# Altium project remote control.PrjPCB
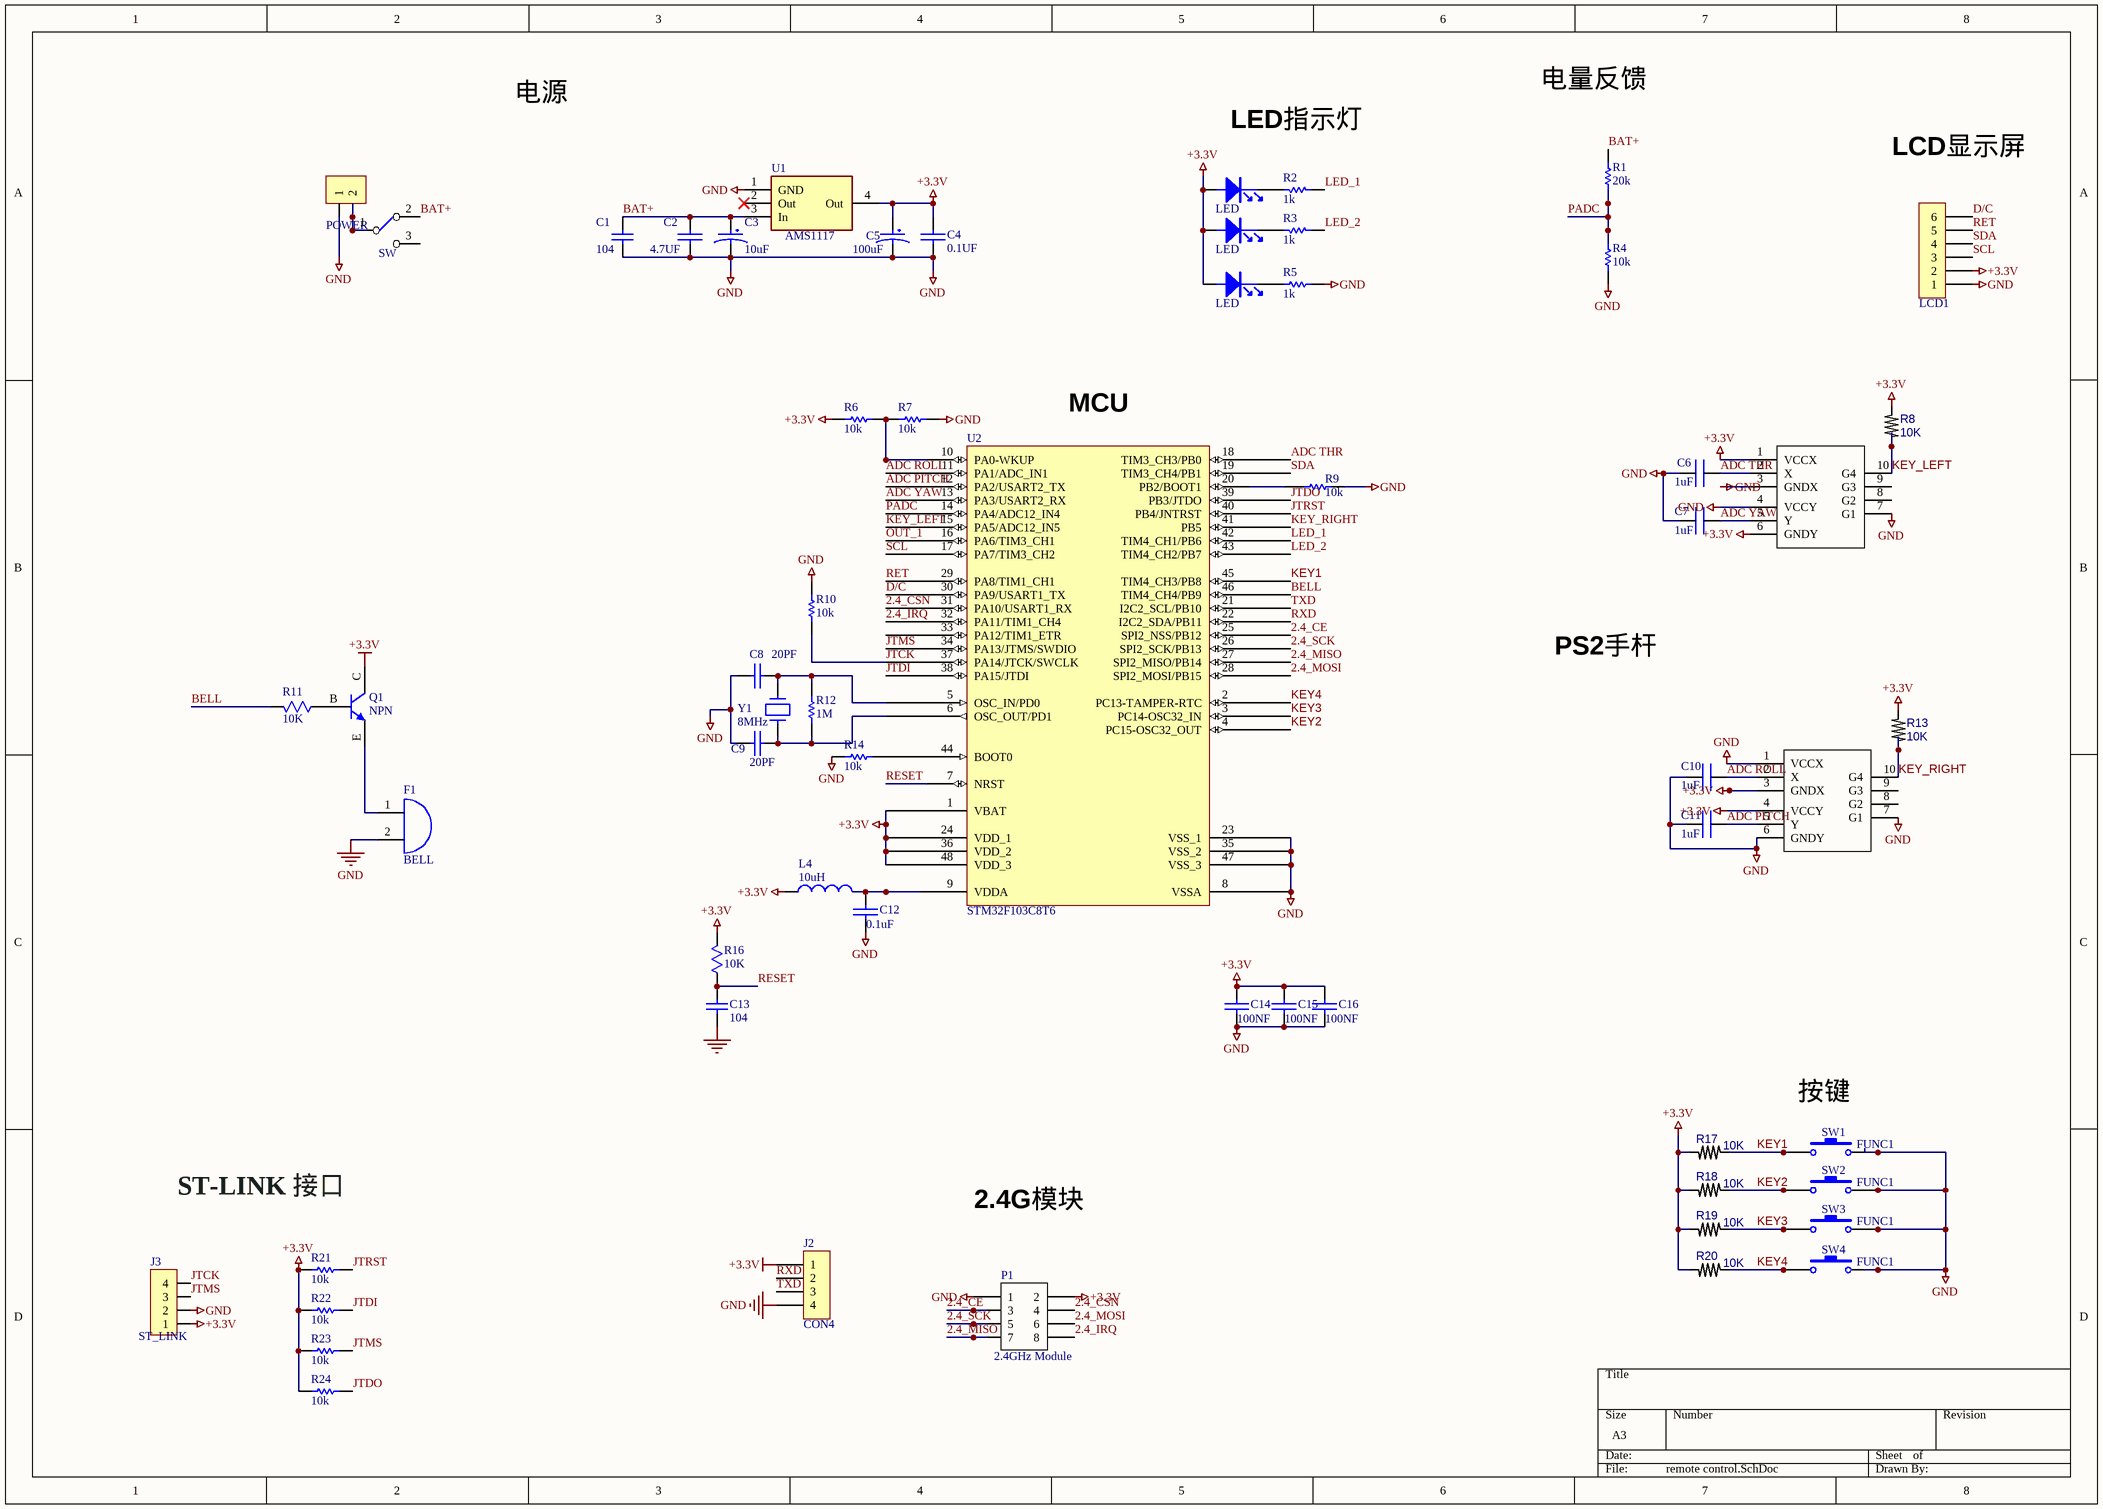
[diagram p0: remote control.SchDoc]
1 sheet, 60 parts. Net scope: global (net labels, ports and power ports of the same name join across sheets).
Board file: remote control.PcbDoc

## Sheet remote control.SchDoc
size A3

### Parts
C1  104  [0805C]
C2  4.7UF  [1206C]
C3  val: 10uF  [C_EC]  (hidden comment: CAPE)
C4  0.1UF  [0805C]
C5  val: 100uF  [C_ED8]  (hidden comment: CAPE)
C6  1uF  [0805C]
C7  1uF  [0805]
C8  20PF  [0805C]
C9  20PF  [0805C]
C10  1uF  [0805]
C11  1uF  [0805]
C12  0.1uF  [0805C]
C13  104  [0805C]
C14  100NF  [0805C]
C15  100NF  [0805C]
C16  100NF  [0805C]
control_L1  Joy Stick  [PS2]  (value not drawn)
control_R1  Joy Stick  [PS2]  (value not drawn)
F1  BELL  [BELL]
J1  POWER  [SIP2]
J2  CON4  [SIP4]
J3  ST_LINK  [P4_2.54-1]
L1  LED  [0805D]
L2  LED  [0805D]
L3  LED  [0805D]
L4  Val: 10uH  [0805]  (hidden comment: INDUCTOR)
LCD1  CON6  [SIP6]  (value not drawn)
P1  2.4GHz Module  [2.4Gmedal]
Q1  NPN  [SOT-23(BEC-123)]
R1  Val: 20k  [0805]  (hidden comment: RES)
R2  value 1k  [0805R]  (hidden comment: Res1)
R3  value 1k  [0805R]  (hidden comment: Res1)
R4  Val: 10k  [0805]  (hidden comment: RES)
R5  value 1k  [0805R]  (hidden comment: Res1)
R6  Val: 10k  [0805]  (hidden comment: RES)
R7  Val: 10k  [0805R]  (hidden comment: RES)
R8  10K  [0805R]
R9  Val: 10k  [0805R]  (hidden comment: RES)
R10  Val: 10k  [0805R]  (hidden comment: RES)
R11  10K  [0805R]
R12  Val: 1M  [0805R]  (hidden comment: RES)
R13  10K  [0805R]
R14  Val: 10k  [0805R]  (hidden comment: RES)
R16  10K  [0805R]
R17  10K  [0805C]
R18  10K  [0805C]
R19  10K  [0805C]
R20  10K  [0805C]
R21  Val: 10k  [0805R]  (hidden comment: RES)
R22  Val: 10k  [0805R]  (hidden comment: RES)
R23  Val: 10k  [0805R]  (hidden comment: RES)
R24  Val: 10k  [0805R]  (hidden comment: RES)
S1  SW  [KEY_DIP_12D07-4]
SW1  FUNC1  [KEY_SIM_6X6]
SW2  FUNC1  [KEY_SIM_6X6]
SW3  FUNC1  [KEY_SIM_6X6]
SW4  FUNC1  [KEY_SIM_6X6]
U1  AMS1117  [SOT223]
U2  STM32F103C8T6  [LQFP48]
Y1  Val: 8MHz  [HC-49T]  (hidden comment: CRYSTAL1)

### Nets
+3.3V: C4.1 C5.1 C14.1 C15.1 C16.1 control_L1.1(VCCX) control_L1.6(GNDY) control_R1.3(GNDX) control_R1.4(VCCY) J2.1 J3.1 L1.1 L2.1 L3.1 L4.1 LCD1.2 P1.2 Q1.C R6.2 R8.2 R13.2 R16.2 R17.1 R18.1 R19.1 R20.1 R21.2 R22.2 R23.2 R24.2 U1.4(Out) U2.1(VBAT) U2.24(VDD_1) U2.36(VDD_2) U2.48(VDD_3)
GND: C1.2 C2.2 C3.2 C4.2 C5.2 C6.1 C7.1 C8.1 C9.1 C10.1 C11.1 C12.2 C13.1 C14.2 C15.2 C16.2 control_L1.3(GNDX) control_L1.4(VCCY) control_L1.7(G1) control_R1.1(VCCX) control_R1.6(GNDY) control_R1.7(G1) F1.2(B) J1.1 J2.4 J3.2 LCD1.1 P1.1 R4.1 R5.1 R7.1 R9.2 R10.2 R14.2 SW1.1 SW2.1 SW3.1 SW4.1 U1.1(GND) U2.8(VSSA) U2.23(VSS_1) U2.35(VSS_2) U2.47(VSS_3)
2.4_CE: P1.3 U2.25(SPI2_NSS/PB12)
2.4_CSN: P1.4 U2.31(PA10/USART1_RX)
2.4_IRQ: P1.8 U2.32(PA11/TIM1_CH4)
2.4_MISO: P1.7 U2.27(SPI2_MISO/PB14)
2.4_MOSI: P1.6 U2.28(SPI2_MOSI/PB15)
2.4_SCK: P1.5 U2.26(SPI2_SCK/PB13)
ADC PITCH: C11.2 control_R1.5(Y) U2.12(PA2/USART2_TX)
ADC ROLL: C10.2 control_R1.2(X) U2.11(PA1/ADC_IN1)
ADC THR: C6.2 control_L1.2(X) U2.18(TIM3_CH3/PB0)
ADC YAW: C7.2 control_L1.5(Y) U2.13(PA3/USART2_RX)
BAT+: C1.1 C2.1 C3.1 R1.2 S1.2 U1.3(In)
BELL: R11.2 U2.46(TIM4_CH4/PB9)
D/C: LCD1.6 U2.30(PA9/USART1_TX)
JTCK: J3.4 R10.1 U2.37(PA14/JTCK/SWCLK)
JTDI: R22.1 U2.38(PA15/JTDI)
JTDO: R24.1 U2.39(PB3/JTDO)
JTMS: J3.3 R23.1 U2.34(PA13/JTMS/SWDIO)
JTRST: R21.1 U2.40(PB4/JNTRST)
KEY1: R17.2 SW1.2 U2.45(TIM4_CH3/PB8)
KEY2: R18.2 SW2.2 U2.4(PC15-OSC32_OUT)
KEY3: R19.2 SW3.2 U2.3(PC14-OSC32_IN)
KEY4: R20.2 SW4.2 U2.2(PC13-TAMPER-RTC)
KEY_LEFT: control_L1.10(G4) R8.1 U2.15(PA5/ADC12_IN5)
KEY_RIGHT: control_R1.10(G4) R13.1 U2.41(PB5)
LED_1: R2.1 U2.42(TIM4_CH1/PB6)
LED_2: R3.1 U2.43(TIM4_CH2/PB7)
OUT_1: U2.16(PA6/TIM3_CH1)
PADC: R1.1 R4.2 U2.14(PA4/ADC12_IN4)
RESET: C13.2 R16.1 U2.7(NRST)
RET: LCD1.5 U2.29(PA8/TIM1_CH1)
RXD: J2.2 U2.22(I2C2_SDA/PB11)
SCL: LCD1.3 U2.17(PA7/TIM3_CH2)
SDA: LCD1.4 U2.19(TIM3_CH4/PB1)
TXD: J2.3 U2.21(I2C2_SCL/PB10)
NetC8_2: C8.2 R12.2 U2.5(OSC_IN/PD0) Y1.2
NetC9_2: C9.2 R12.1 U2.6(OSC_OUT/PD1) Y1.1
NetC12_1: C12.1 L4.2 U2.9(VDDA)
NetF1_1: F1.1(A) Q1.E
NetJ1_2: J1.2 S1.1
NetL1_2: L1.2 R2.2
NetL2_2: L2.2 R3.2
NetL3_2: L3.2 R5.2
NetQ1_B: Q1.B R11.1
NetR6_1: R6.1 R7.2 U2.10(PA0-WKUP)
NetR9_1: R9.1 U2.20(PB2/BOOT1)
NetR14_1: R14.1 U2.44(BOOT0)

Not connected (* = marked no-connect by the designer): control_L1 8(G2) 9(G3); control_R1 8(G2) 9(G3); S1 3; U1 2(Out)*; U2 33(PA12/TIM1_ETR)

### Notes on the sheet
- 电源
- 电量反馈
- LED指示灯
- LCD显示屏
- (near U2) MCU
- PS2手杆
- (near SW1) 按键
- ST-LINK 接口
- 2.4G模块

### Library data of the parts
C1 = Cap: Capacitor; Published: 8-Jun-2000; LatestRevisionDate: 17-Jul-2002; LatestRevisionNote: Re-released for DXP Platform.; PackageReference: RAD-0.3; Publisher: Altium Limited
C2 C4 C8 C9 C12 C14-C16 = CAP: Capacitor/小容量电容
C6 C7 C10 C11 = CAP
C13 = CAP: GRM39 X7R102K50PT; Value: 100pF; Published: 8-Jun-2000; Revision: July-2002: Re-released for DXP Platform.; Publisher: Altium Limited; REF: GRM39 X7R102K50PT
control_L1 control_R1 = Joy Stick: Header, 10-Pin, Dual row; LatestRevisionDate: 17-Jul-2002; LatestRevisionNote: Re-released for DXP Platform.; Publisher: Altium Limited
J1 = SIP2
J3 = SIP4
P1 = Header 4X2: Header, 10-Pin, Dual row; LatestRevisionDate: 17-Jul-2002; LatestRevisionNote: Re-released for DXP Platform.; Publisher: Altium Limited
R1 R4 R6 R7 R9 R10 R12 R14 R21-R24 = RES: Semiconductor Resistor; Published: *; LatestRevisionDate: *; LatestRevisionNote: *; PackageReference: *; Publisher: *
R2 R3 R5 = Res1: Resistor; Published: 8-Jun-2000; LatestRevisionDate: 17-Jul-2002; LatestRevisionNote: Re-released for DXP Platform.; Publisher: Altium Limited
R8 R11 R13 R16-R20 = RES
S1 = SW_拨动_小型
SW1-SW4 = SW-PB: Switch; Published: 24-Mar-1999; LatestRevisionDate: 17-Jul-2002; LatestRevisionNote: Re-released for DXP Platform.; PackageReference: SPST-2; Publisher: Altium Limited
U1 = AMS1117: Header, 2-Pin; LatestRevisionDate: *; LatestRevisionNote: *; Publisher: *
U2 = STM32F103C8T6: STM32 ARM-based 32-bit MCU with 64 Kbytes Flash, 48-pin LQFP, Industrial Temperature; Published: *; DatasheetVersion: *; PackageVersion: *; PackageReference: *; Publisher: *; PackageDescription: *; ComponentLink1Description: *; ComponentLink1URL: *; ComponentLink2Description: *; ComponentLink2URL: *